# EAGLE design filament width sensor v3.12 opt (EAGLE 7.6.0)
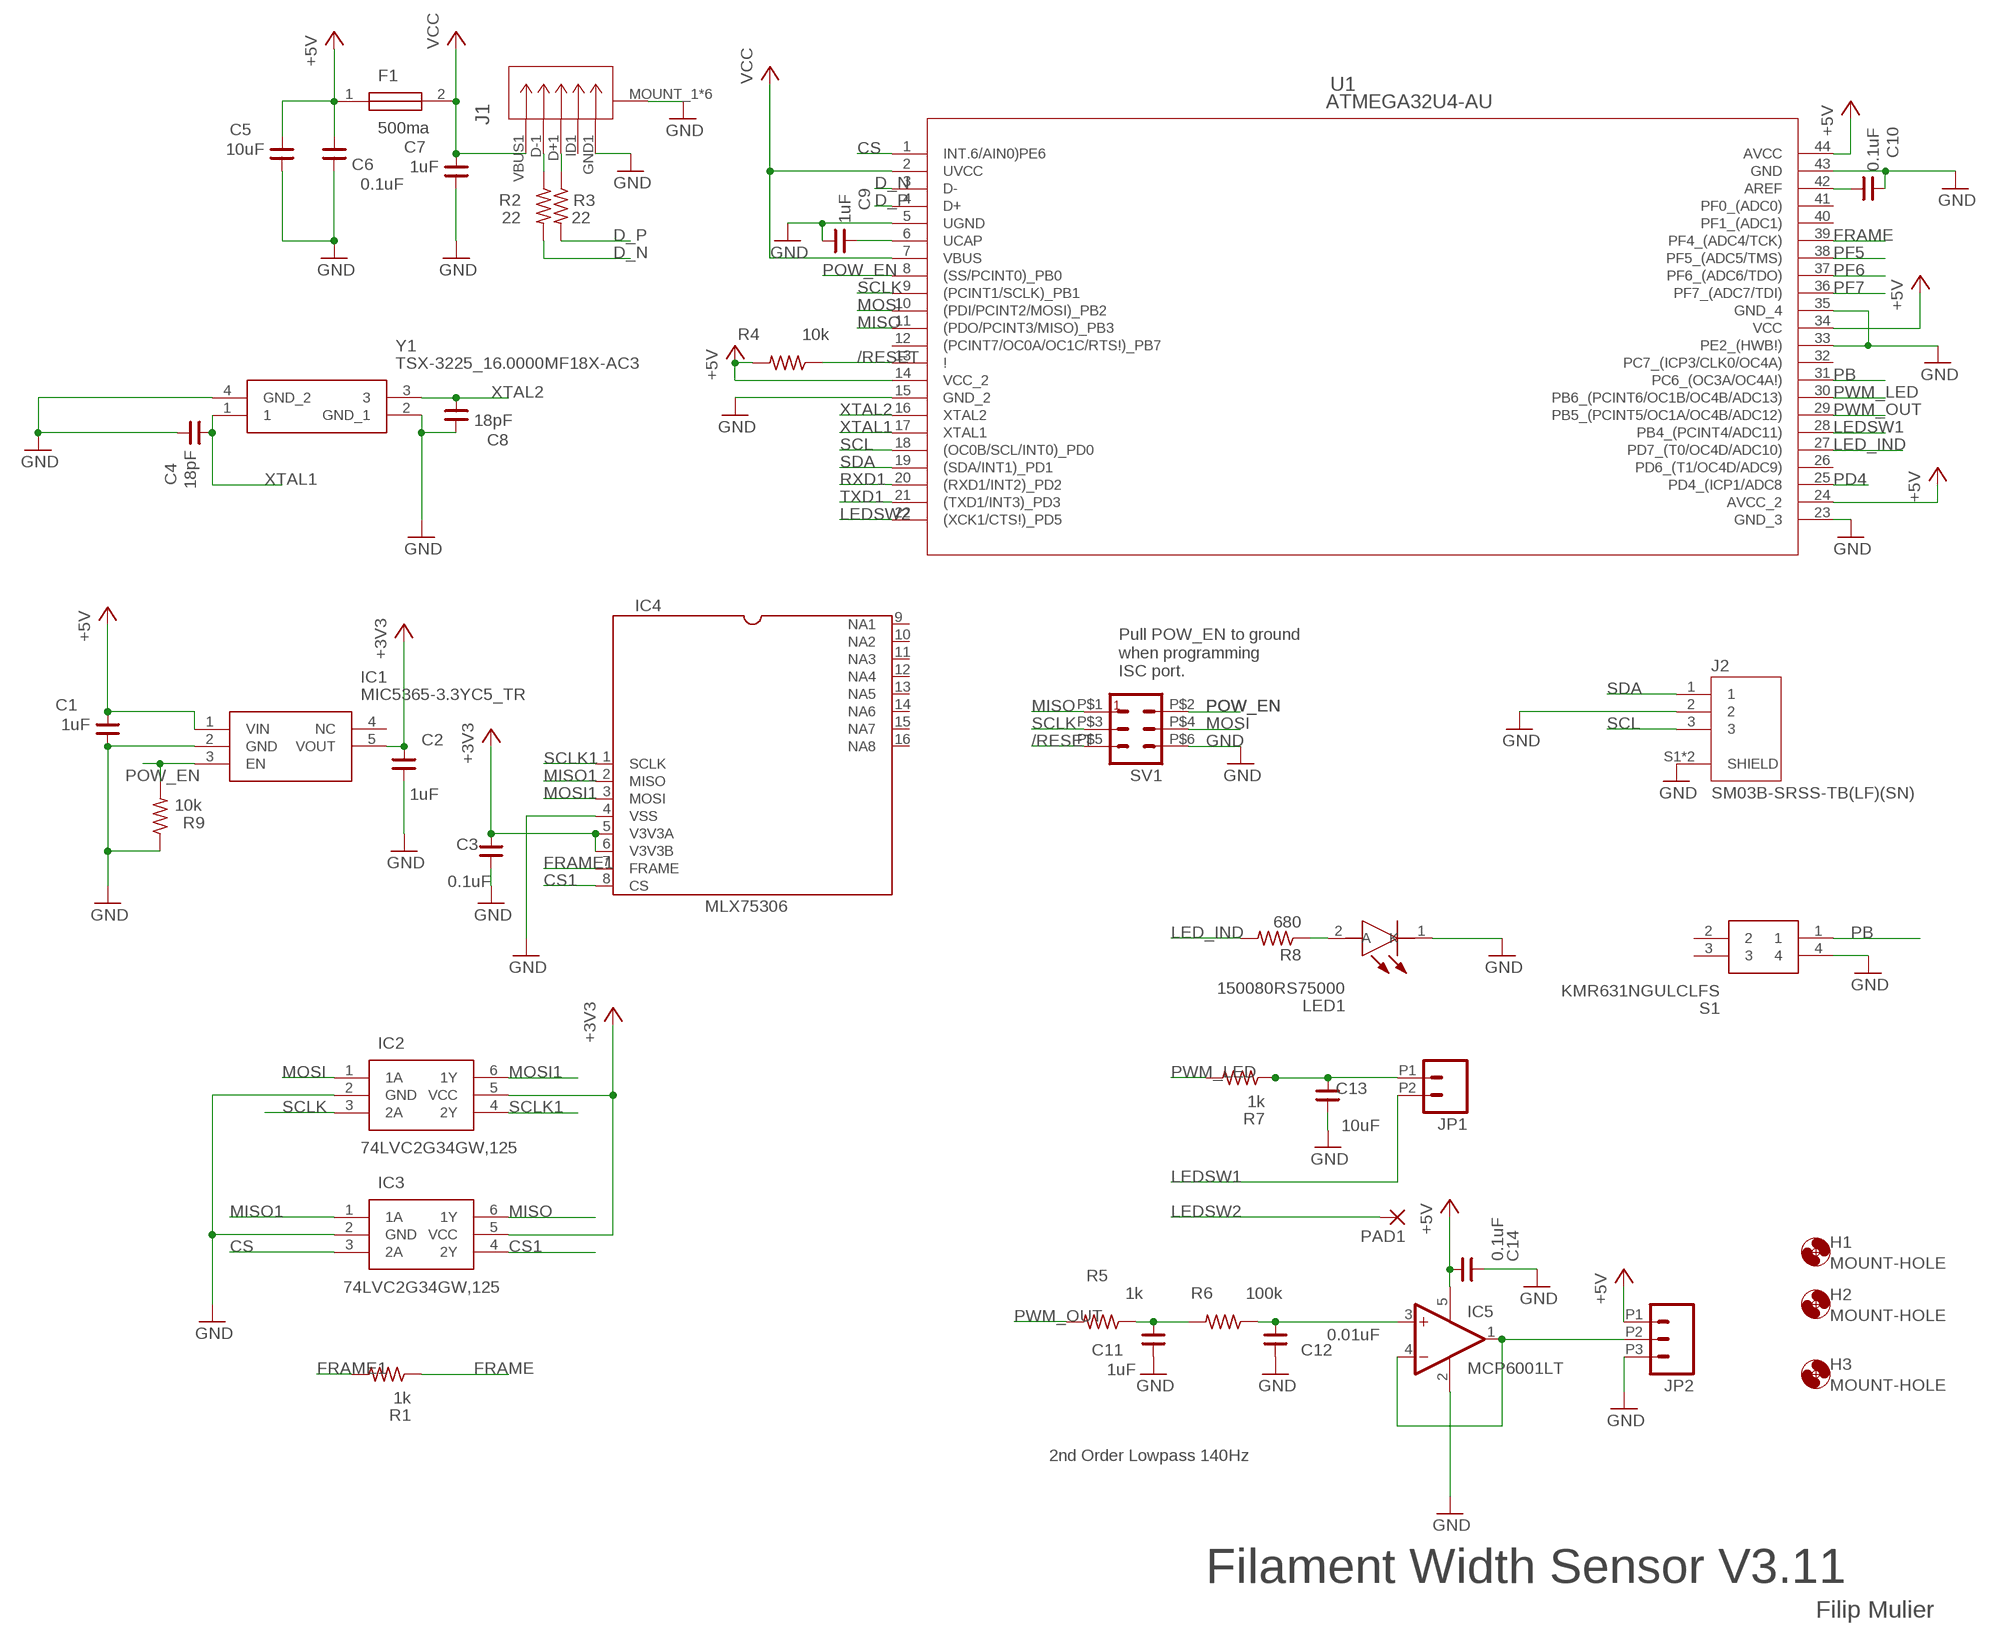
[diagram p0: schematic, sheet 1]

## Parts
C1  1uF  CNP-0603  [0603]
C2  1uF  CNP-0603  [0603]
C3  0.1uF  CNP-0603  [0603]
C4  18pF  CNP-0603  [0603]
C5  10uF  CNP-0805  [0805]
C6  0.1uF  CNP-0603  [0603]
C7  1uF  CNP-0603  [0603]
C8  18pF  CNP-0603  [0603]
C9  1uF  CNP-0603  [0603]
C10  0.1uF  CNP-0603  [0603]
C11  1uF  CNP-0603  [0603]
C12  0.01uF  CNP-0603  [0603]
C13  10uF  CNP-0805  [0805]
C14  0.1uF  CNP-0603  [0603]
F1  500ma  0ZCJ0025FF2E  [FUSC3216X75N]
H1  MOUNT-HOLE  [SCREWHOLE2-56]
H2  MOUNT-HOLE  [SCREWHOLE2-56]
H3  MOUNT-HOLE  [SCREWHOLE2-56]
IC1  MIC5365-3.3YC5_TR  MIC5365-3.0YC5_TR  [SOT65P210X110-5N]
IC2  74LVC2G34GW,125  [SOP65P210X110-6N]
IC3  74LVC2G34GW,125  [SOP65P210X110-6N]
IC4  MLX75306  [SO16NBC]
IC5  MCP6001LT  [MCP6001_SC70-5]
J1  USB  ZX62D-B-5PA8(30)  [CONN5_ZX62D-B-5PA8_HIR]
J2  SM03B-SRSS-TB(LF)(SN)  [JST_SM03B-SRSS-TB(LF)(SN)]
JP1  M022.54MM_SCREWTERM  [1X02_2.54_SCREWTERM]
JP2  M03SCREW2.54  [1X03_2.54_SCREWTERM]
LED1  150080RS75000  [LEDC2012X80N]
PAD1  WIREPAD1,6/0,8  [1,6/0,8]
R1  1k  R-US_R0603  [R0603]
R2  22  R-US_R0603  [R0603]
R3  22  R-US_R0603  [R0603]
R4  10k  R-US_R0603  [R0603]
R5  1k  R-US_R0603  [R0603]
R6  100k  R-US_R0603  [R0603]
R7  1k  R-US_R0603  [R0603]
R8  680  R-US_R0603  [R0603]
R9  10k  R-US_R0603  [R0603]
S1  KMR631NGULCLFS  [KMR621NG]
SV1  MA03-2SMD  [MA03-2SMT]
U1  ATMEGA32U4-AU  [44ML_ATM]
Y1  TSX-3225_16.0000MF18X-AC3  [TSX-3225V]

## Nets
+3V3: C2.2 C3.2 IC1.5(VOUT) IC2.5(VCC) IC3.5(VCC) IC4.5(V3V3A) IC4.6(V3V3B)
+5V: C1.2 C5.2 C6.2 C14.2 F1.1 IC1.1(VIN) IC5.5(V+) JP2.P1 R4.2 U1.14(VCC_2) U1.24(AVCC_2) U1.34(VCC) U1.44(AVCC)
/RESET: R4.1 SV1.P$5 U1.13(!)
ADC9: IC5.1(OUT) IC5.4(-IN) JP2.P2
CS: IC3.3(2A) U1.1(INT.6/AIN0)PE6)
CS1: IC3.4(2Y) IC4.8(CS)
D1_N: J1.D+1 R3.1
D1_P: J1.D-1 R2.1
D_N: R2.2 U1.3(D-)
D_P: R3.2 U1.4(D+)
FRAME: R1.1 U1.39(PF4_(ADC4/TCK))
FRAME1: IC4.7(FRAME) R1.2
GND: C1.1 C2.1 C3.1 C4.2 C5.1 C6.1 C7.1 C8.2 C9.1 C10.2 C11.1 C12.1 C13.1 C14.1 IC1.2(GND) IC2.2(GND) IC3.2(GND) IC4.4(VSS) IC5.2(V-) J1.GND1 J1.MOUNT_1(CASE_GND) J1.MOUNT_2(CASE_GND) J1.MOUNT_3(CASE_GND) J1.MOUNT_4(CASE_GND) J1.PAD_1(CASE_GND) J1.PAD_2(CASE_GND) J2.2 J2.S1(SHIELD) J2.S2(SHIELD) JP2.P3 LED1.1(K) R9.1 S1.4 SV1.P$6 U1.5(UGND) U1.15(GND_2) U1.23(GND_3) U1.33(PE2_(HWB!)) U1.35(GND_4) U1.43(GND) Y1.2(GND_1) Y1.4(GND_2)
LED_IND: R8.2 U1.27(PD7_(T0/OC4D/ADC10))
LEDSW1: JP1.P2 U1.28(PB4_(PCINT4/ADC11))
LEDSW2: PAD1.1(P) U1.22((XCK1/CTS!)_PD5)
MISO: IC3.6(1Y) SV1.P$1 U1.11((PDO/PCINT3/MISO)_PB3)
MISO1: IC3.1(1A) IC4.2(MISO)
MOSI: IC2.1(1A) SV1.P$4 U1.10((PDI/PCINT2/MOSI)_PB2)
MOSI1: IC2.6(1Y) IC4.3(MOSI)
N$2: C9.2 U1.6(UCAP)
N$4: C10.1 U1.42(AREF)
N$5: C13.2 JP1.P1 R7.1
N$6: C11.2 R5.1 R6.2
N$7: C12.2 IC5.3(+IN) R6.1
N$17: LED1.2(A) R8.1
PB: S1.1 U1.31(PC6_(OC3A/OC4A!))
PD4: U1.25(PD4_(ICP1/ADC8)
PF5: U1.38(PF5_(ADC5/TMS))
PF6: U1.37(PF6_(ADC6/TDO))
PF7: U1.36(PF7_(ADC7/TDI))
POW_EN: IC1.3(EN) R9.2 SV1.P$2 U1.8((SS/PCINT0)_PB0)
PWM_LED: R7.2 U1.30(PB6_(PCINT6/OC1B/OC4B/ADC13))
PWM_OUT: R5.2 U1.29(PB5_(PCINT5/OC1A/OC4B/ADC12))
RXD1: U1.20((RXD1/INT2)_PD2)
SCL: J2.3 U1.18((OC0B/SCL/INT0)_PD0)
SCLK: IC2.3(2A) SV1.P$3 U1.9((PCINT1/SCLK)_PB1)
SCLK1: IC2.4(2Y) IC4.1(SCLK)
SDA: J2.1 U1.19((SDA/INT1)_PD1)
TXD1: U1.21((TXD1/INT3)_PD3)
VCC: C7.2 F1.2 J1.VBUS1 U1.2(UVCC) U1.7(VBUS)
XTAL1: C4.1 U1.17(XTAL1) Y1.1
XTAL2: C8.1 U1.16(XTAL2) Y1.3
Unconnected: IC1.4(NC) IC4.9(NA1) IC4.10(NA2) IC4.11(NA3) IC4.12(NA4) IC4.13(NA5) IC4.14(NA6) IC4.15(NA7) IC4.16(NA8) J1.ID1 S1.2 S1.3 U1.12((PCINT7/OC0A/OC1C/RTS!)_PB7) U1.26(PD6_(T1/OC4D/ADC9)) U1.32(PC7_(ICP3/CLK0/OC4A)) U1.40(PF1_(ADC1)) U1.41(PF0_(ADC0))

## Notes on the sheet
- Pull POW_EN to ground 
  when programming
  ISC port.
- 2nd Order Lowpass 140Hz
- Filament Width Sensor V3.11
- Filip Mulier

## Library data of the parts
C1-C14 = cap-master:CNP-: NON-POLARIZED CAP
F1 = SamacSys_Parts:0ZCJ0025FF2E: BEL FUSE - CIRCUIT PROTECTION - 0ZCJ0025FF2E - FUSE, RESETTABLE PTC, 16VDC, 0.25A, SMD Source: Datasheet <https://componentsearchengine.com/Datasheets/2/0ZCJ0025FF2E.pdf>; DESCRIPTION: BEL FUSE - CIRCUIT PROTECTION - 0ZCJ0025FF2E - FUSE, RESETTABLE PTC, 16VDC, 0.25A, SMD; HEIGHT: 0.75mm; MANUFACTURER_NAME: Bel Circuit Protection; MANUFACTURER_PART_NUMBER: 0ZCJ0025FF2E
H1-H3 = filip:MOUNT-HOLE: MOUNTING HOLE with drill center marker
IC1 = SamacSys_Parts:MIC5365-3.0YC5_TR: LDO Regulator Pos 3.0V 0.15A 5-Pin SC-70 T/R Source: Datasheet <http://ww1.microchip.com/downloads/en/DeviceDoc/mic5365.pdf>; DESCRIPTION: LDO Regulator Pos 3.0V 0.15A 5-Pin SC-70 T/R; HEIGHT: 1.1mm; MANUFACTURER_NAME: Microchip; MANUFACTURER_PART_NUMBER: MIC5365-3.0YC5 TR
IC2 IC3 = SamacSys_Parts:74LVC2G34GW,125: 74LVC2G34 - Dual buffer gate@en-us Source: Datasheet <https://assets.nexperia.com/documents/data-sheet/74LVC2G34.pdf>; DESCRIPTION: 74LVC2G34 - Dual buffer gate@en-us; HEIGHT: 1.1mm; MANUFACTURER_NAME: Nexperia; MANUFACTURER_PART_NUMBER: 74LVC2G34GW,125; MOUSER_PART_NUMBER: 771-LVC2G34GW125; MOUSER_PRICE-STOCK: https://www.mouser.co.uk/ProductDetail/Nexperia/74LVC2G34GW125?qs=me8TqzrmIYUOkg5J0C6mqA%3D%3D
IC4 = filip:MLX75306
IC5 = filip:MCP6001: The Microchip Technology Inc. MCP6001/2/4 family of operational amplifiers (op amps) is specifically designed for general-purpose applications. This family has a 1 MHz Gain Bandwidth Product (GBWP) and 90° phase margin (typ.). It also maintains 45° phase margin (typ.) with a 500 pF capacitive load. This family operates from a single supply voltage as low as 1.8V, while drawing 100 μA (typ.) quiescent current. Additionally, the MCP6001/2/4 supports rail-to-rail input and output swing, with a common mode input voltage range of V DD +300mV to V SS – 300 mV. This family of op amps is designed with Microchip’s advanced CMOS process.
J1 = USB_jacks:ZX62D-B-5PA8(30); MANUFACTURER_PART_NUMBER: ZX62D-B-5PA8(30); SOURCELIBRARY: Hirose_2018-12-15; VENDOR: Hirose
J2 = JST:SM03B-SRSS-TB(LF)(SN): SH Series 3 Position 1 mm Pitch Surface Mount Side Entry Shrouded Header; DESCRIPTION: Connector Header Surface Mount, Right Angle 3 position 0.039 (1.00mm); DIGI-KEY_PART_NUMBER: 455-1803-1-ND; MF: JST Sales; MP: SM03B-SRSS-TB(LF)(SN); PACKAGE: None; PURCHASE-URL: https://pricing.snapeda.com/search/part/SM03B-SRSS-TB(LF)(SN)/?ref=eda
JP1 = filip:M02: Standard 2-pin 0.1" header. Use with - straight break away headers ( PRT-00116) - right angle break away headers (PRT-00553) - swiss pins (PRT-00743) - machine pins (PRT-00117) - female headers (PRT-00115) Molex polarized connector foot print use with: PRT-08233 with associated crimp pins and housings. 2.54_SCREWTERM for use with PRT-10571. 3.5mm Screw Terminal footprints for PRT-08084 5mm Screw Terminal footprints for use with PRT-08433
JP2 = filip:M03: Header 3 Standard 3-pin 0.1" header. Use with straight break away headers (SKU : PRT-00116), right angle break away headers (PRT-00553), swiss pins (PRT-00743), machine pins (PRT-00117), and female headers (PRT-00115). Molex polarized connector foot print use with SKU : PRT-08232 with associated crimp pins and housings.
LED1 = SamacSys_Parts:150080RS75000: LED,Wurth Elektronik,150080RS75000 Wurth Elektronik 150080RS75000, WL-SMCW Series Red LED, 625 nm 2012 (0805) Clear, Rectangle Lens SMD package Source: Datasheet <https://componentsearchengine.com/Datasheets/2/150080RS75000.pdf>; DESCRIPTION: LED,Wurth Elektronik,150080RS75000 Wurth Elektronik 150080RS75000, WL-SMCW Series Red LED, 625 nm 2012 (0805) Clear, Rectangle Lens SMD package; HEIGHT: 0.8mm; MANUFACTURER_NAME: Wurth Elektronik; MANUFACTURER_PART_NUMBER: 150080RS75000; MOUSER_PART_NUMBER: 710-150080RS75000; MOUSER_PRICE-STOCK: https://www.mouser.co.uk/ProductDetail/Wurth-Elektronik/150080RS75000?qs=LlUlMxKIyB2jdCo7bnfgew%3D%3D
PAD1 = wirepad:WIREPAD: Wire PAD connect wire on PCB
R1-R9 = rcl:R-US_: RESISTOR, American symbol
S1 = SamacSys_Parts:KMR631NGULCLFS: KMR631NGULCLFS (Tactile Switches) Source: Datasheet <https://www.ckswitches.com/media/1907/kmr6.pdf>; DESCRIPTION: KMR631NGULCLFS (Tactile Switches); HEIGHT: mm; MANUFACTURER_NAME: C & K COMPONENTS; MANUFACTURER_PART_NUMBER: KMR631NGULCLFS; MOUSER_PART_NUMBER: 611-KMR631NGULCLFS; MOUSER_PRICE-STOCK: https://www.mouser.co.uk/ProductDetail/CK/KMR631NGULCLFS?qs=HXFqYaX1Q2xBA5gT0%2FzYzA%3D%3D
SV1 = filip:MA03-2: PIN HEADER
U1 = ATMEGA32U4:ATMEGA32U4-AU; BUILT_BY: EMA_UL_Team; MANUFACTURER_PART_NUMBER: ATMEGA32U4-AU; SOURCELIBRARY: Atmel_2011-04-02; VENDOR: Atmel
Y1 = SamacSys_Parts:TSX-3225_16.0000MF18X-AC3: MHz Range crystal unit Source: Datasheet <https://support.epson.biz/td/api/doc_check.php?dl=brief_FA-238V_en.pdf>; DESCRIPTION: MHz Range crystal unit; HEIGHT: mm; MANUFACTURER_NAME: Epson Timing; MANUFACTURER_PART_NUMBER: TSX-3225 16.0000MF18X-AC3; MOUSER_PART_NUMBER: 732-TX325-16F18X-AC3; MOUSER_PRICE-STOCK: https://www.mouser.co.uk/ProductDetail/Epson-Timing/TSX-3225-160000MF18X-AC3?qs=tC2qD9afNgpyT7dDEnDRhg%3D%3D

## Board
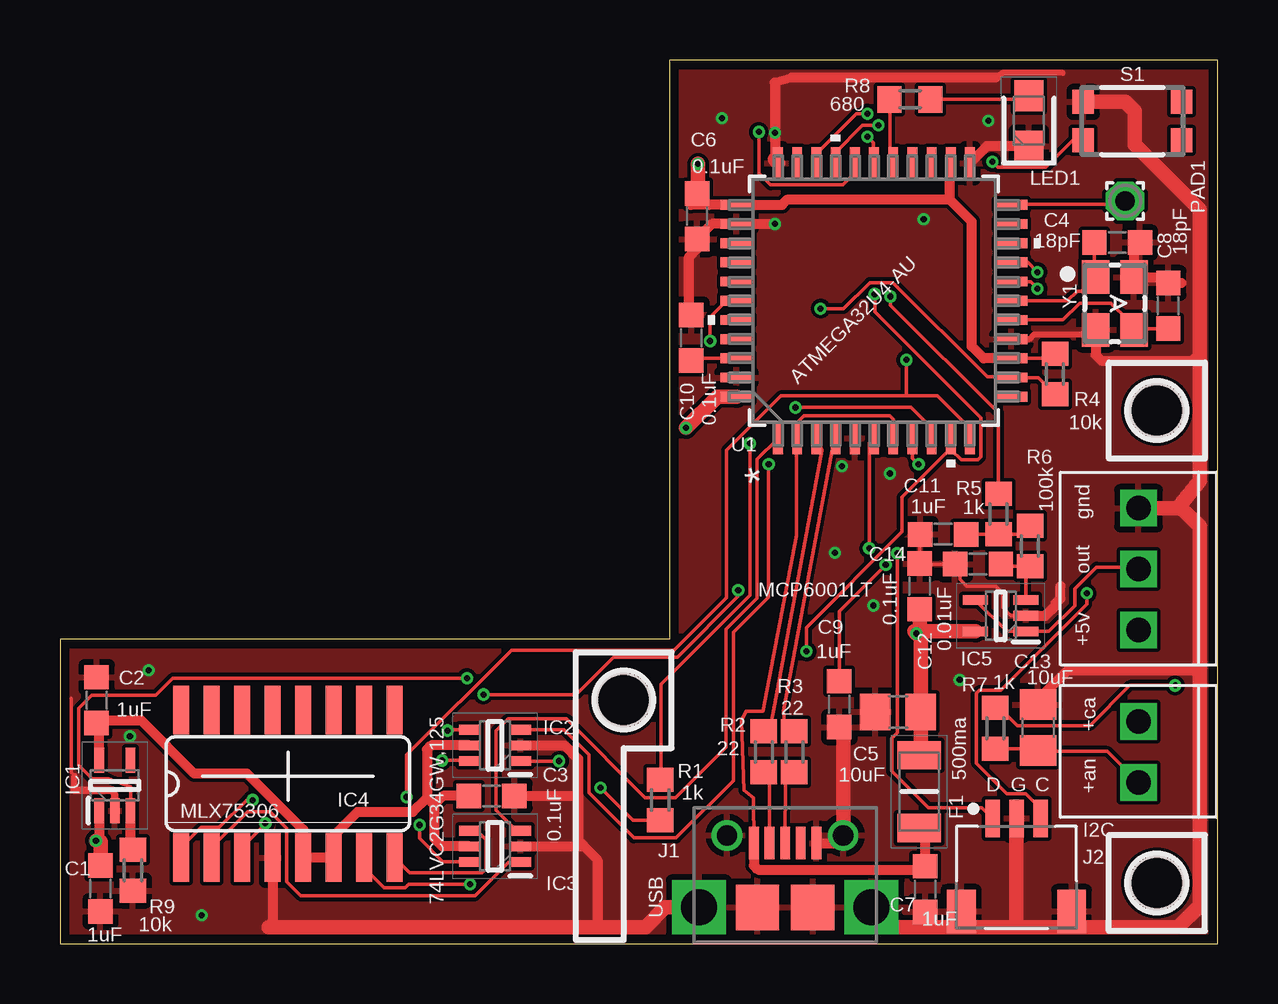
[diagram p1: board, top side]
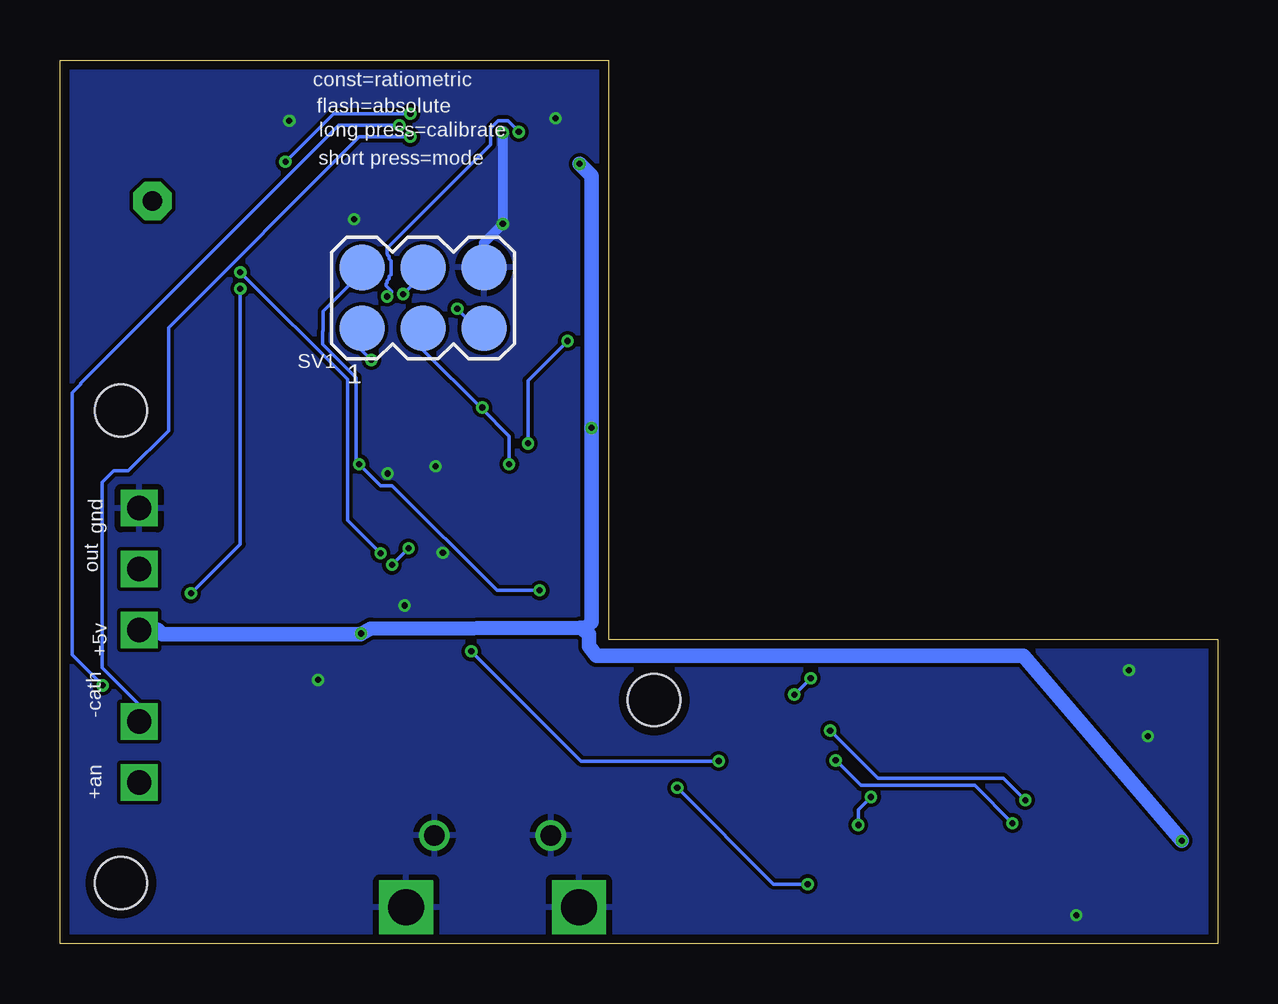
[diagram p2: board, bottom side, seen from below]

Size 48.26 x 36.83 mm. Coordinates in mm from the lower left corner, seen from the top.
Outline: 48.26,0 48.26,36.83 25.4,36.83 25.4,12.7 0,12.7 0,0 48.26,0
Copper layers (1*16): Top 0.035559375mm / dielectric 1.6mm / Bottom 0.035559375mm
Design rules "oshpark-2layer *": minimum track width 6mil, minimum drill 10mil, track to track 6mil, track to pad 6mil, pad to pad 6mil, via to via 6mil, smd to smd 6mil, copper to edge 15mil, drill to drill 6mil, minimum pad ring 5mil, minimum via ring 5mil, stop-mask expansion 2.5mil, vias tented up to drill 0mil, thermal gap 10mil

### Footprints (pad centres in the part's own frame; a part is rotated, then mirrored left to right if it is on the bottom)
0603 = smd 1.016 x 1.016: 1 -0.953,0; 2 0.953,0
0805 = smd 1.27 x 1.524: 1 -0.953,0; 2 0.953,0
FUSC3216X75N = smd 1.17 x 1.82: 1 -1.52,0; 2 1.52,0
SCREWHOLE2-56 = hole 2.184: 0,0
SOT65P210X110-5N = smd 1.05 x 0.4: 1 -1.05,0.65; 2 -1.05,0; 3 -1.05,-0.65; 4 1.05,-0.65; 5 1.05,0.65
SOP65P210X110-6N = smd 0.875 x 0.4: 1 -1.062,0.65; 2 -1.062,0; 3 -1.062,-0.65; 4 1.062,-0.65; 5 1.062,0; 6 1.062,0.65
SO16NBC = smd 0.66 x 2.032: 1 -4.469,-3.387; 2 -3.199,-3.387; 3 -1.929,-3.387; 4 -0.659,-3.387; 5 0.611,-3.387; 6 1.881,-3.387; 7 3.151,-3.387; 8 4.421,-3.387; 9 4.421,2.76; 10 3.151,2.76; 11 1.881,2.76; 12 0.611,2.76; 13 -0.659,2.76; 14 -1.929,2.76; 15 -3.199,2.76; 16 -4.469,2.76
MCP6001_SC70-5 = smd 1.05 x 0.4: 1 -1.05,0.65; 2 -1.05,0; 3 -1.05,-0.65; 4 1.05,-0.65; 5 1.05,0.65
CONN5_ZX62D-B-5PA8_HIR = smd 0.406 x 1.346: D+1 0,2.675; D-1 -0.65,2.675; GND1 1.3,2.675; ID1 0.65,2.675; VBUS1 -1.3,2.675 | drill 0.85 pad 1.25: MOUNT_1 -2.425,3; MOUNT_2 2.425,3 | drill 1.5 pad 1.9 square: MOUNT_3 3.6,0; MOUNT_4 -3.6,0 | smd 1.8 x 1.9: PAD_1 -1.15,0; PAD_2 1.15,0
JST_SM03B-SRSS-TB(LF)(SN) = smd 0.6 x 1.55: 1 -1,0; 2 0,0; 3 1,0 | smd 1.2 x 1.8: S1 -2.3,-3.875; S2 2.3,-3.875
1X02_2.54_SCREWTERM = drill 1.016 square: P1 2.54,0; P2 0,0
1X03_2.54_SCREWTERM = drill 1.016 square: P1 2.54,0; P2 0,0; P3 -2.54,0
LEDC2012X80N = smd 1.3 x 1.2: 1 -1.05,0; 2 1.05,0
1,6/0,8 = drill 0.813 pad 1.6 octagon: 1 0,0
R0603 = smd 1 x 1.1: 1 -0.85,0; 2 0.85,0
KMR621NG = smd 0.9 x 1: 1 -2.05,-0.8; 2 2.05,-0.8; 3 2.05,0.8; 4 -2.05,0.8
MA03-2SMT = smd 1.905 x 1.905: P$1 -2.54,-1.27; P$2 -2.54,1.27; P$3 0,-1.27; P$4 0,1.27; P$5 2.54,-1.27; P$6 2.54,1.27
44ML_ATM = smd 1.346 x 0.406: 1 -5.728,4; 2 -5.728,3.2; 3 -5.728,2.4; 4 -5.728,1.6; 5 -5.728,0.8; 6 -5.728,0; 7 -5.728,-0.8; 8 -5.728,-1.6; 9 -5.728,-2.4; 10 -5.728,-3.2; 11 -5.728,-4; 23 5.728,-4; 24 5.728,-3.2; 25 5.728,-2.4; 26 5.728,-1.6; 27 5.728,-0.8; 28 5.728,0; 29 5.728,0.8; 30 5.728,1.6; 31 5.728,2.4; 32 5.728,3.2; 33 5.728,4 | smd 0.406 x 1.346: 12 -4,-5.728; 13 -3.2,-5.728; 14 -2.4,-5.728; 15 -1.6,-5.728; 16 -0.8,-5.728; 17 0,-5.728; 18 0.8,-5.728; 19 1.6,-5.728; 20 2.4,-5.728; 21 3.2,-5.728; 22 4,-5.728; 34 4,5.728; 35 3.2,5.728; 36 2.4,5.728; 37 1.6,5.728; 38 0.8,5.728; 39 0,5.728; 40 -0.8,5.728; 41 -1.6,5.728; 42 -2.4,5.728; 43 -3.2,5.728; 44 -4,5.728
TSX-3225V = smd 1.4 x 1.15: 1 -1.1,-0.8; 2 1.1,-0.8; 3 1.1,0.8; 4 -1.1,0.8

### Placement (x,y rotation side)
C1  1.69,2.31 90 top
C2  1.52,10.16 270 top
C3  17.99,6.17 180 top
C4  44.07,29.23 0 top
C5  34.93,9.67 0 top
C6  26.56,30.32 90 top
C7  36.07,2.29 90 top
C8  46.2,26.59 90 top
C9  32.48,9.99 90 top
C10  26.32,25.26 90 top
C11  36.81,17.07 0 top
C12  38.26,15.82 0 top
C13  40.77,9.02 270 top
C14  35.84,14.9 270 top
F1  35.81,6.35 270 top
H1  45.72,22.23 0 top
H2  45.72,2.54 0 top
H3  23.5,10.16 0 top
IC1  2.29,6.6 90 top
IC2  18.13,8.27 180 top
IC3  18.13,4.06 180 top
IC4  9.53,6.99 0 top
IC5  39.21,13.67 180 top
J1  30.23,1.52 0 top
J2  39.87,5.23 0 top
JP1  44.96,9.27 270 top
JP2  44.96,15.62 270 top
LED1  40.39,34.29 90 top
PAD1  44.4,30.96 0 top
R1  25.02,6 270 top
R2  29.34,8 90 top
R3  30.61,8 90 top
R4  41.48,23.75 90 top
R5  39.12,17.91 90 top
R6  40.43,16.58 90 top
R7  38.98,8.99 90 top
R8  35.43,35.19 180 top
R9  3.04,3.07 90 top
S1  44.7,34.29 0 top
SV1  33.13,26.91 0 bottom
U1  33.93,26.8 90 top
Y1  43.97,26.69 270 top

### Tracks (layer width: path | path; a pad name or v marks a point on that pad's centre or on a via)
+3V3
  Top 0.406: IC1.5 1.64,9.1 C2.2 1.62,9.3 3.4,9.3 5.6,7.1 7.8,7.1 10.14,4.76 IC4.5 IC4.6 11.41,4.51 12.4,5.5 14.7,5.5 15.3,6.1 | C3.2 15.97,6.17 15.6,5.8 | 15.6,5.8 15.6,4.4 15.94,4.06 IC3.5 | IC2.5 15.47,8.27 15.3,8.1 15.3,6.1 | 15.3,6.1 15.6,5.8
+5V  (via drill 0.25)
  Top 0.152: U1.14 41.27,24.4 R4.2 | 37.2,32.46 U1.24
  Top 0.406: IC1.1 1.64,3.91 | 1.64,3.91 C1.2 | 1.64,3.91 1.64,3.63 | U1.14 38.5,24.4 38,24.9 38,30.1 37.1,31 | 37.1,31 37.1,32.5 U1.24 | 37.1,31 30.3,31 30.1,30.8 U1.34 | U1.34 27.04,30.8 C6.2 | U1.34 26.3,30.8
  Top 0.61: F1.1 35.88,7.94 C5.2 35.88,12.75 v35.7,12.93 | v1.5,4.3 1.7,4.25 C1.2 | v26.6,32.5 26.6,31.32 C6.2 | U1.44 27.4,22.8 v26.1,21.5 | IC5.5 35.61,13.02 v35.7,12.93 | C14.2 35.84,13.07 v35.7,12.93
  Bottom 0.61: v35.7,12.93 35.3,13.13 | 35.3,13.13 26.58,13.18 | 26.58,13.18 26.2,12.9 26.2,12.4 25.9,12 8.1,12 v1.5,4.3 | 26.58,13.18 26.32,13.18 26.1,13.4 v26.1,21.5 26.1,32 v26.6,32.5 | v35.7,12.93 35.3,13.13 | JP2.P1 44.18,13.08 44,12.9 35.73,12.9 v35.7,12.93
/RESET  (via drill 0.25)
  Top 0.152: R4.1 40.78,23.6 U1.13 39.6,23.62 38.66,23.62 34.72,27.56 33.76,27.56 32.66,26.47 v31.7,26.47
  Bottom 0.152: v31.7,26.47 30.89,25.65 30.61,25.65 SV1.P$5
ADC9
  Top 0.152: JP2.P2 44.88,15.7 43.2,15.7 42.3,14.8 42.3,14.1 41.22,13.02 IC5.1 39.46,13.02 IC5.4
CS
  Top 0.152: IC3.3 19.18,4.72 19.02,4.72 18.19,5.56 18.19,8.89 18.67,9.37 21.11,9.37 24.38,6.1 25.65,6.1 27.76,8.2 27.76,13.11 29.06,14.4 29.06,20.19 29.92,21.06 U1.1
CS1
  Top 0.152: IC3.4 17.4,4.7 17.75,4.34 17.75,3.12 17.6,2.97 14.58,2.97 13.97,3.58 IC4.8
D1_N
  Top 0.152: J1.D+1 30.25,6.88 30.6,7.1 | 30.6,7.1 30.67,7.15 | R3.1 30.61,7.11 30.6,7.1
D1_P
  Top 0.152: J1.D-1 29.58,6.83 29.45,7 29.39,7.1 R2.1
D_N
  Top 0.152: R2.2 29.64,9.19 29.74,9.7 31.77,20.58 U1.3
D_P
  Top 0.152: R3.2 30.21,9.14 30.16,9.7 32.17,20.52 U1.4
FRAME  (via drill 0.25)
  Top 0.152: 25.04,6.86 R1.1 25.04,6.93 25.04,10.82 28.75,14.53 v28.75,20.85 | v27.1,25.12 27.1,26.11 27.79,26.8 U1.39
  Bottom 0.152: v28.75,20.85 28.75,23.47 v27.1,25.12
FRAME1  (via drill 0.25)
  Top 0.152: v22.53,6.5 23.88,5.16 R1.2 | v17.09,2.49 14.53,2.49 14.38,2.34 13.51,2.34 12.7,3.15 12.7,3.58 IC4.7
  Bottom 0.152: v22.53,6.5 18.52,2.49 v17.09,2.49
GND  (via drill 0.25)
  Top 0.152: IC5.2 39.63,13.67 39.3,14 39.3,14.6 39,14.9 37.8,14.9 37.5,15.2 37.5,15.63 C12.1 35.86,15.82 C14.1 35.84,17.04 C11.1 | 0.46,10.24 0.46,7.14 0.6,7
  Top 0.254: 41.8,36.3 39.3,36.3 39,36.1 | 42.75,35.35 42.45,35.35 | U1.15 40.4,25.2 40.6,25.4 42.98,25.4 | 0.6,6.4 0.6,7
  Top 0.305: IC1.2 2.29,6.21 2.2,6.4 0.6,6.4
  Top 0.356: 30.5,36.1 29.8,35.9
  Top 0.406: IC4.4 8.87,0.87 8.7,0.7 | IC3.2 21.84,4.06 | 21.84,4.06 22.4,3.5 22.4,0.9 22.6,0.7 | IC2.2 21.03,8.27 21.6,7.7 21.6,6.2 | 21.6,6.2 21.6,4.3 21.84,4.06 | C3.1 21.57,6.17 21.6,6.2 | J1.GND1 32.33,4.2 J1.MOUNT_2 | C10.2 26.2,26.33 26.2,28.6 26.56,28.96 C6.1 27.19,30 U1.35 v29.8,30 | C4.2 44.77,28.98 Y1.4 45.95,27.79 | 29.8,35.9 v29.8,33.8 29.8,32.7 | 39,36.1 30.5,36.1 | U1.23 38.64,33.24 LED1.1 40.8,33.24 | 42.98,25.4 Y1.2 | 47.47,29.23 47.5,29.2 | Y1.2 43.17,25.77 | Y1.2 43.17,24.53 43.4,24.3 47.2,24.3 47.5,24.6 | C8.2 46.74,27.54 | C13.1 40.77,10.17 42,11.4 47.5,11.4 | IC5.2 41.07,13.67 41.5,14.1 41.5,14.2 41.7,14.4 41.7,14.9
  Top 0.61: JP2.P3 46.74,18.16 | 46.74,18.16 47.5,17.4 47.5,11.4 47.5,1.6 46.6,0.7 42.5,0.7 | 42.5,0.7 39.7,0.7 | 39.7,0.7 37.5,0.7 | 37.5,0.7 36.3,0.7 | 36.3,0.7 34.65,0.7 J1.MOUNT_3 | J2.S2 42.17,1.03 42.5,0.7 | J2.S1 37.57,0.77 37.5,0.7 | C7.1 36.07,0.93 36.3,0.7 | J2.2 39.87,0.87 39.7,0.7 | J1.MOUNT_4 25.22,1.52 24.4,0.7 22.6,0.7 8.7,0.7 | J1.MOUNT_2 32.65,8.87 C9.1 | 46.74,18.16 46.74,18.34 47.5,19.3 47.5,24.6 47.5,29.2 47.5,30.6 44.8,33.3 44.8,34.7 44.4,35.1 42.66,35.1 S1.4 42.75,35.35 | 29.8,32.7 U1.33
  Bottom 0.406: SV1.P$6 30.59,29.21 v29.8,30 v29.8,33.8
  other vias: 32.6,19.9 32.3,16.3 34.6,19.6 37.5,11 2.92,8.65 3.7,11.4 36,30.2 27.6,34.4 38.7,34.3 5.9,1.2 33.9,14.1
  pour Top: 0.64,0 48.26,0 48.26,36.83 25.4,36.83 25.4,12.7 0,12.7 0,0
  pour Bottom: 0,0 48.26,0 48.26,36.83 25.4,36.83 25.4,12.7 0,12.7
LED_IND
  Top 0.152: R8.2 34.59,35.18 34.59,32.66 U1.27
LEDSW1  (via drill 0.25)
  Top 0.152: v33.66,33.63 33.91,33.38 33.91,32.54 U1.28
  Bottom 0.152: v33.66,33.63 35.79,33.63 43.74,25.68 43.74,21.39 45.41,19.71 46.02,19.71 46.51,19.23 46.51,11.51 44.96,9.96 JP1.P2
LEDSW2
  Top 0.152: U1.22 39.67,30.81 44.27,30.81 44.4,30.94 PAD1.1
MISO  (via drill 0.25)
  Top 0.152: v14.99,4.95 14.99,4.39 15.95,3.43 17.04,3.43 IC3.6 | v14.45,6.12 14.45,7.87 18.82,12.24 25.6,12.24 27.79,14.43 27.79,20.57 30.05,22.84 35.28,22.84 | 35.28,22.84 36.58,22.84 37.92,21.49 37.92,21.08 U1.11 | 35.28,22.84 v35.28,24.33
  Bottom 0.152: v14.99,4.95 14.99,5.59 v14.45,6.12 | v35.28,24.33 35.66,24.71 SV1.P$1
MISO1
  Top 0.152: IC3.1 19.18,3.4 18.69,3.4 17.3,2.01 10.03,2.01 9.45,2.59 9.45,4.83 8.76,5.51 7.82,5.51 6.35,4.04 6.35,3.61 IC4.2
MOSI  (via drill 0.25)
  Top 0.152: v20.8,7.62 19.2,7.62 IC2.1 | v31.11,12.19 31.11,13.18 35.1,17.17 35.1,18.62 37.11,20.62 37.11,21.06 U1.10 37.16,20.57 37.57,20.17 38.25,20.17 38.38,20.3 38.38,21.92 33.96,26.34 v33.96,27.08
  Bottom 0.152: v20.8,7.62 26.54,7.62 v31.11,12.19 | v33.96,27.08 33.15,27.89 33.15,28.17 SV1.P$4
MOSI1  (via drill 0.25)
  Top 0.152: v15.93,7.64 17.04,7.64 IC2.6 | v8.56,5.03 8.56,4.98 7.62,4.04 7.62,3.61 IC4.3
  Bottom 0.152: v15.93,7.64 14.88,6.6 10.13,6.6 v8.56,5.03
N$2  (via drill 0.25)
  Top 0.152: v34.42,15.8 32.49,13.87 C9.2 | v33.73,16.48 33.73,20.88 33.91,21.06 U1.6
  Bottom 0.152: v33.73,16.48 v34.42,15.8
N$4
  Top 0.152: U1.42 26.41,24.4 C10.1
N$5
  Top 0.152: R7.1 38.99,8.13 40.72,8.13 40.77,8.08 C13.2 40.82,8.03 43.66,8.03 JP1.P1
N$6
  Top 0.152: C11.2 R5.1 40.07,17.06 R6.2
N$7
  Top 0.152: IC5.3 40.26,15.56 R6.1 39.31,15.73 C12.2
N$17
  Top 0.152: R8.1 36.3,35.2 40.26,35.2 LED1.2
PB  (via drill 0.25)
  Top 0.152: v38.86,32.59 39.09,32.36 41.1,32.36 42.22,33.48 42.65,33.48 S1.1 | v33.66,34.59 33.2,34.59 31.55,32.94 31.55,32.54 U1.31
  Bottom 0.152: v38.86,32.59 36.85,34.59 v33.66,34.59
POW_EN  (via drill 0.25)
  Top 0.152: v35.79,19.99 35.53,20.24 35.53,21.06 U1.8 | v16.97,11.07 4.7,11.07 3.99,10.36 1.32,10.36 0.79,9.83 0.79,7.44 1.35,6.88 2.01,6.88 2.94,6.54 2.94,5.74 IC1.3 | v17.65,10.39 21.51,10.39 23.06,11.94 25.73,11.94 28.27,14.48 v28.27,14.73
  Top 0.406: IC1.3 2.94,4.03 R9.2
  Bottom 0.152: SV1.P$2 35.69,28.17 35.69,27.96 37.29,26.36 37.29,25.55 37.31,25.53 37.31,24.99 35.92,23.6 35.92,20.12 v35.79,19.99 34.9,19.1 34.42,19.1 30.05,14.73 v28.27,14.73 | v17.65,10.39 v16.97,11.07
PWM_LED  (via drill 0.25)
  Top 0.152: v46.48,10.77 44.6,10.77 42.93,9.09 39.9,9.09 39.17,9.83 R7.2 | v34.11,34.11 33.45,34.11 32.33,32.99 U1.30
  Bottom 0.152: v46.48,10.77 47.75,12.04 47.75,22.96 47.4,23.32 47.4,23.37 36.65,34.11 v34.11,34.11
PWM_OUT  (via drill 0.25)
  Top 0.152: v34.62,26.98 34.62,26.62 39.12,22.12 39.12,18.77 R5.2 | v29.13,33.83 29.13,32.11 29.62,31.62 32.64,31.62 33.12,32.11 33.12,32.51 U1.29
  Bottom 0.152: v34.62,26.98 34.44,27.15 34.44,27.2 34.67,27.43 34.67,27.51 34.62,27.56 34.62,27.64 34.54,27.71 34.54,27.81 34.47,27.89 34.47,28.47 34.54,28.55 34.54,28.65 34.59,28.7 34.59,28.73 34.62,28.75 34.62,28.98 30.3,33.3 30.3,33.98 30,34.29 29.59,34.29 v29.13,33.83
SCL  (via drill 0.25)
  Top 0.152: v40.74,27.3 40.46,27.58 39.67,27.58 U1.18 | v42.8,14.61 42.8,14.15 39.22,10.57 38.33,10.57 38.2,10.44 38.2,7.52 39.47,6.25 40.26,6.25 40.84,5.66 40.84,5.23 J2.3
  Bottom 0.152: v40.74,27.3 40.74,16.66 v42.8,14.61
SCLK  (via drill 0.25)
  Top 0.152: v29.54,19.99 29.54,14.45 28.07,12.98 28.07,6.81 25.68,4.42 23.93,4.42 22.05,6.3 22.05,7.87 21.01,8.91 19.2,8.91 IC2.3 | 36.32,21.49 36.32,21.08 U1.9 36.27,21.54 35.46,22.35 v30.66,22.35
  Bottom 0.152: v29.54,19.99 29.54,21.16 30.7,22.31 | 30.7,22.31 33.15,24.77 33.15,25.63 SV1.P$3 | v30.66,22.35 30.7,22.31
SCLK1  (via drill 0.25)
  Top 0.152: v16.15,8.89 16.18,8.91 17.04,8.91 IC2.4 | v8.03,5.99 7.77,5.99 6.63,4.85 5.89,4.85 5.08,4.04 5.08,3.61 IC4.1
  Bottom 0.152: v16.15,8.89 14.17,6.91 8.94,6.91 v8.03,5.99
SDA  (via drill 0.25)
  Top 0.152: v40.74,27.99 40.34,28.4 39.67,28.4 U1.19 | v34.9,16.28 34.9,8.79 34.67,8.56 34.67,7.19 36.2,5.66 38.43,5.66 J2.1
  Bottom 0.152: v40.74,27.99 36.27,23.52 36.27,17.65 v34.9,16.28
VCC
  Top 0.152: J1.VBUS1 28.9,6.1 28.5,6.4 28.4,9.3 28.6,9.7 29.3,9.7 30.7,17 30.7,20.5 U1.2 30.7,21.1 30.7,21.7 31,22 34.6,22 34.73,21.87 U1.7
  Top 0.406: J1.VBUS1 28.93,3.27 29.1,3.1 35.73,3.1 C7.2 36.07,4.58 F1.2
XTAL1
  Top 0.152: C4.1 43.12,27.84 Y1.1 42.58,27.2 42.4,27.2 42,26.8 U1.17
XTAL2
  Top 0.152: C8.1 44.82,25.64 Y1.3 44.5,25.86 44.5,26 43.8,26.7 42.5,26.7 41.8,26 U1.16

### Text on the board
tNames: gnd | out | +5v | +ca | +an
bNames: const=ratiometric | flash=absolute | long press=calibrate | short press=mode | gnd | out | +5v | -cath | +an
bValues: LED2 | Filament sensor V3.12 Jan 2021 | Objects with Intelligence LLC
_tsilk: D | G | C | I2C